# EAGLE design breakout-a-bit (EAGLE 7.7.0)
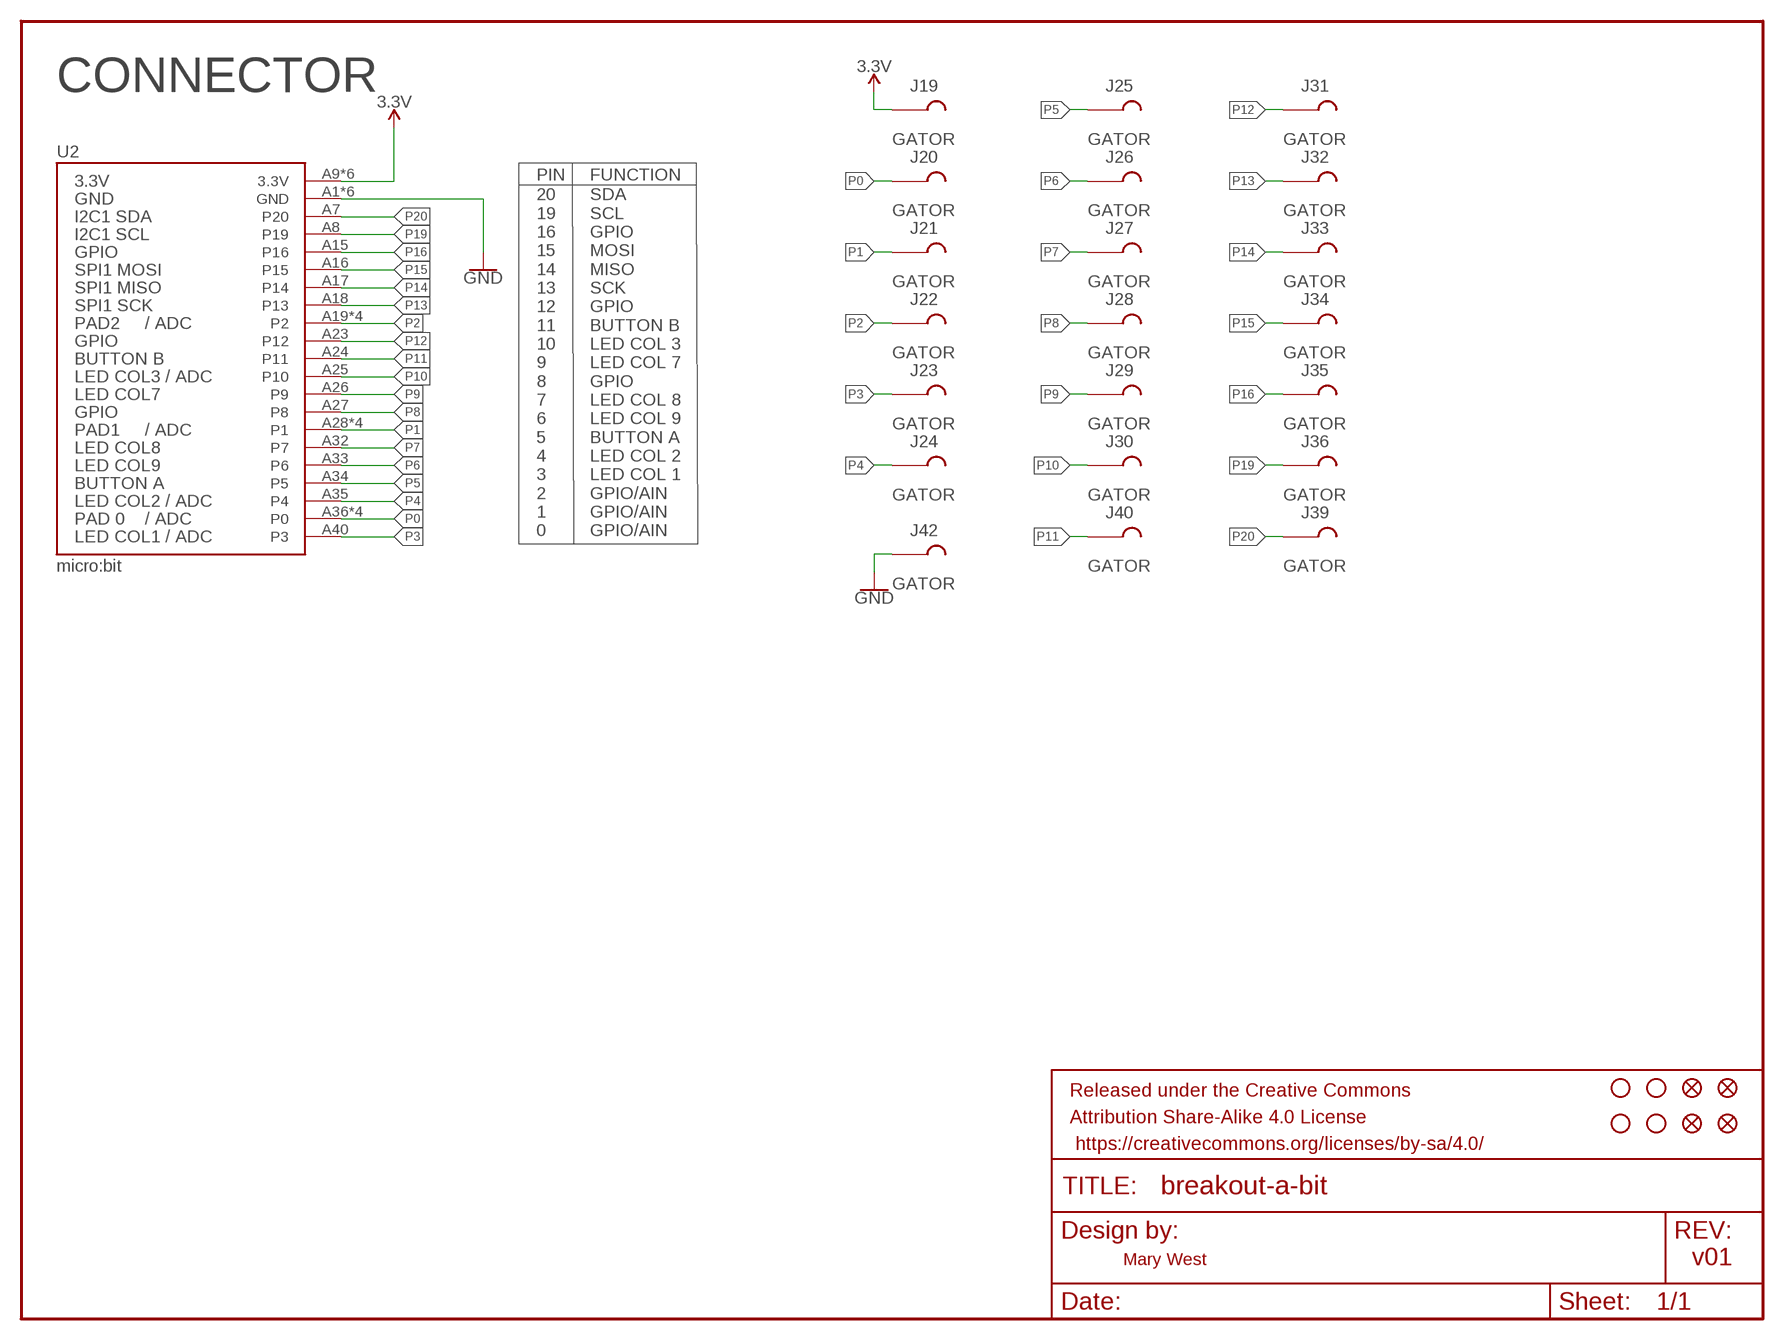
[diagram p0: schematic, sheet 1]

## Parts
FD1  FIDUCIAL1X2  [FIDUCIAL-1X2]
FD2  FIDUCIAL1X2  [FIDUCIAL-1X2]
FD3  FIDUCIAL1X2  [FIDUCIAL-1X2]
FD4  FIDUCIAL1X2  [FIDUCIAL-1X2]
FRAME1  FRAME-LETTER  [CREATIVE_COMMONS]
H1  STAND-OFF  [STAND-OFF]
H2  STAND-OFF  [STAND-OFF]
H3  STAND-OFF  [STAND-OFF]
H4  STAND-OFF  [STAND-OFF]
J19  GATOR  [GATOR]
J20  GATOR  [GATOR]
J21  GATOR  [GATOR]
J22  GATOR  [GATOR]
J23  GATOR  [GATOR]
J24  GATOR  [GATOR]
J25  GATOR  [GATOR]
J26  GATOR  [GATOR]
J27  GATOR  [GATOR]
J28  GATOR  [GATOR]
J29  GATOR  [GATOR]
J30  GATOR  [GATOR]
J31  GATOR  [GATOR]
J32  GATOR  [GATOR]
J33  GATOR  [GATOR]
J34  GATOR  [GATOR]
J35  GATOR  [GATOR]
J36  GATOR  [GATOR]
J39  GATOR  [GATOR]
J40  GATOR  [GATOR]
J42  GATOR  [GATOR]
U2  micro:bit  MICRO:BITLEDS_UP  [MICRO:BIT_RA_PTH]

## Nets
3.3V: J19.P$1 U2.A9(3.3V) U2.A10(3.3V) U2.A11(3.3V) U2.A12(3.3V) U2.A13(3.3V) U2.A14(3.3V)
GND: J42.P$1 U2.A1(GND) U2.A2(GND) U2.A3(GND) U2.A4(GND) U2.A5(GND) U2.A6(GND)
P0: J20.P$1 U2.A36(P0) U2.A37(P0) U2.A38(P0) U2.A39(P0)
P1: J21.P$1 U2.A28(P1) U2.A29(P1) U2.A30(P1) U2.A31(P1)
P2: J22.P$1 U2.A19(P2) U2.A20(P2) U2.A21(P2) U2.A22(P2)
P3: J23.P$1 U2.A40(P3)
P4: J24.P$1 U2.A35(P4)
P5: J25.P$1 U2.A34(P5)
P6: J26.P$1 U2.A33(P6)
P7: J27.P$1 U2.A32(P7)
P8: J28.P$1 U2.A27(P8)
P9: J29.P$1 U2.A26(P9)
P10: J30.P$1 U2.A25(P10)
P11: J40.P$1 U2.A24(P11)
P12: J31.P$1 U2.A23(P12)
P13: J32.P$1 U2.A18(P13)
P14: J33.P$1 U2.A17(P14)
P15: J34.P$1 U2.A16(P15)
P16: J35.P$1 U2.A15(P16)
P19: J36.P$1 U2.A8(P19)
P20: J39.P$1 U2.A7(P20)

## Notes on the sheet
- CONNECTOR
- PIN | FUNCTION
- 20
  19
  16
  15
  14
  13
  12
  11
  10
  9
  8
  7
  6
  5
  4
  3
  2
  1
  0
- SDA
  SCL
  GPIO
  MOSI
  MISO
  SCK
  GPIO
  BUTTON B
  LED COL 3
  LED COL 7
  GPIO
  LED COL 8
  LED COL 9
  BUTTON A
  LED COL 2
  LED COL 1
  GPIO/AIN
  GPIO/AIN
  GPIO/AIN
- Mary West | v01

## Library data of the parts
FD1-FD4 = SparkFun-Aesthetics:FIDUCIAL: Fiducial Alignment Points Point-of-reference for pick-and-place machines and other optical instruments.
FRAME1 = SparkFun-Aesthetics:FRAME-LETTER: Schematic Frame - Letter Standard 8.5x11 US Letter frame
H1-H4 = SparkFun-Electromechanical:STAND-OFF: #4 Stand Off This is the mechanical footprint for a #4 phillips button head screw. Use the keepout ring to avoid running the screw head into surrounding components. SKU : PRT-00447
J19-J36 J39 J40 J42 = TAB:GATOR
U2 = Micro_Bit_Parts:MICRO:BIT: BBC MICRO_BIT with 5x5 LED array facing the direction noted in the variant. "UP" means away from the host board, "Down" means facing towards the host board.; PROD_ID: CONN-13452

## Board
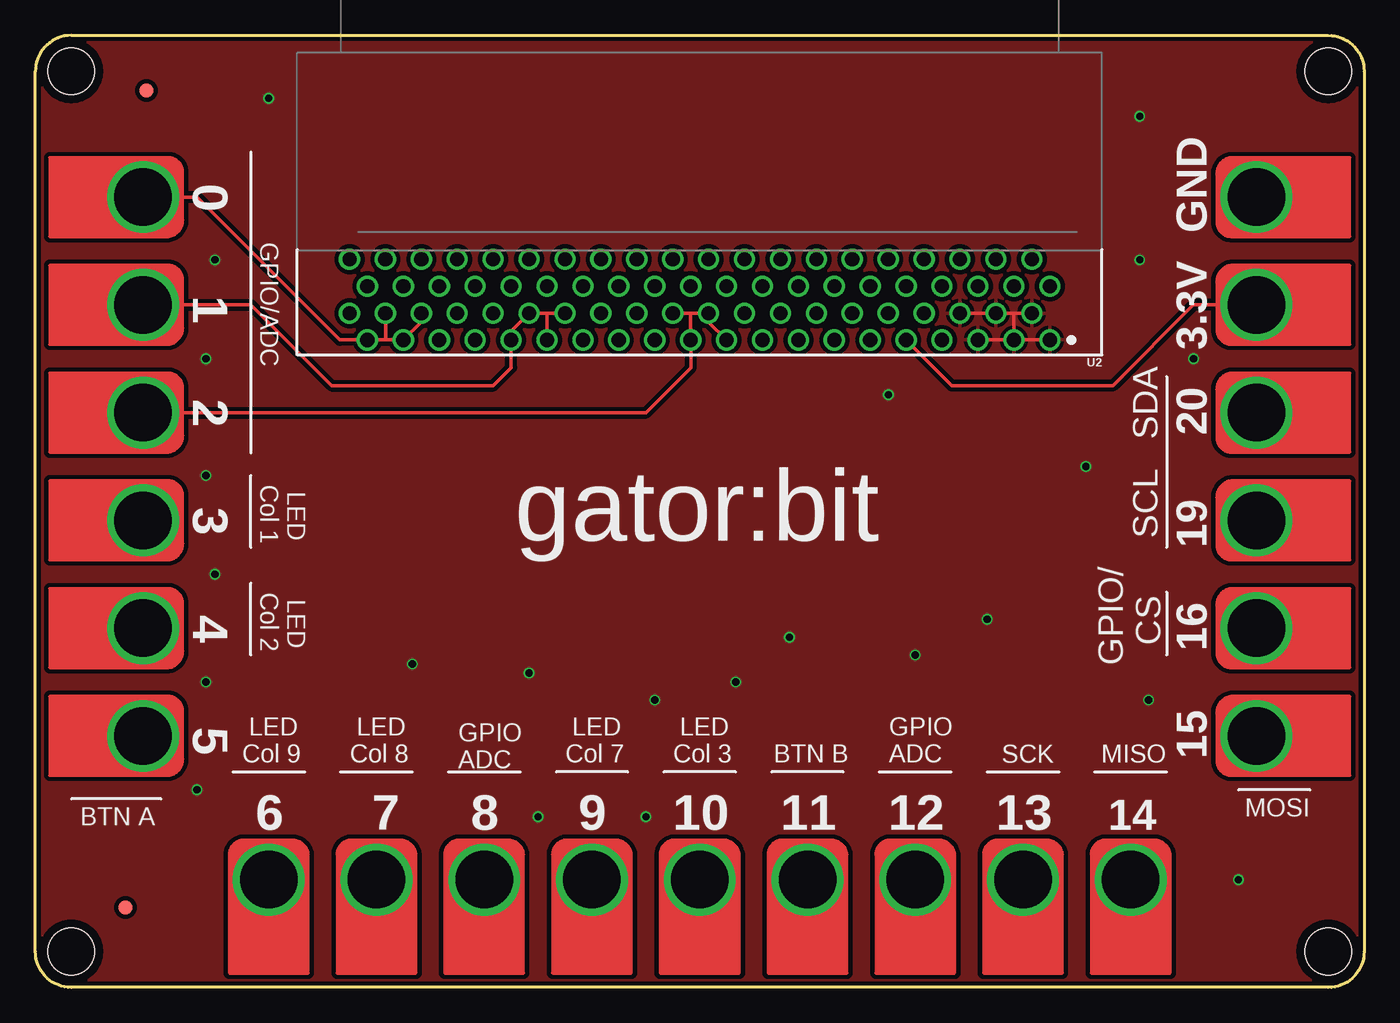
[diagram p1: board, top side]
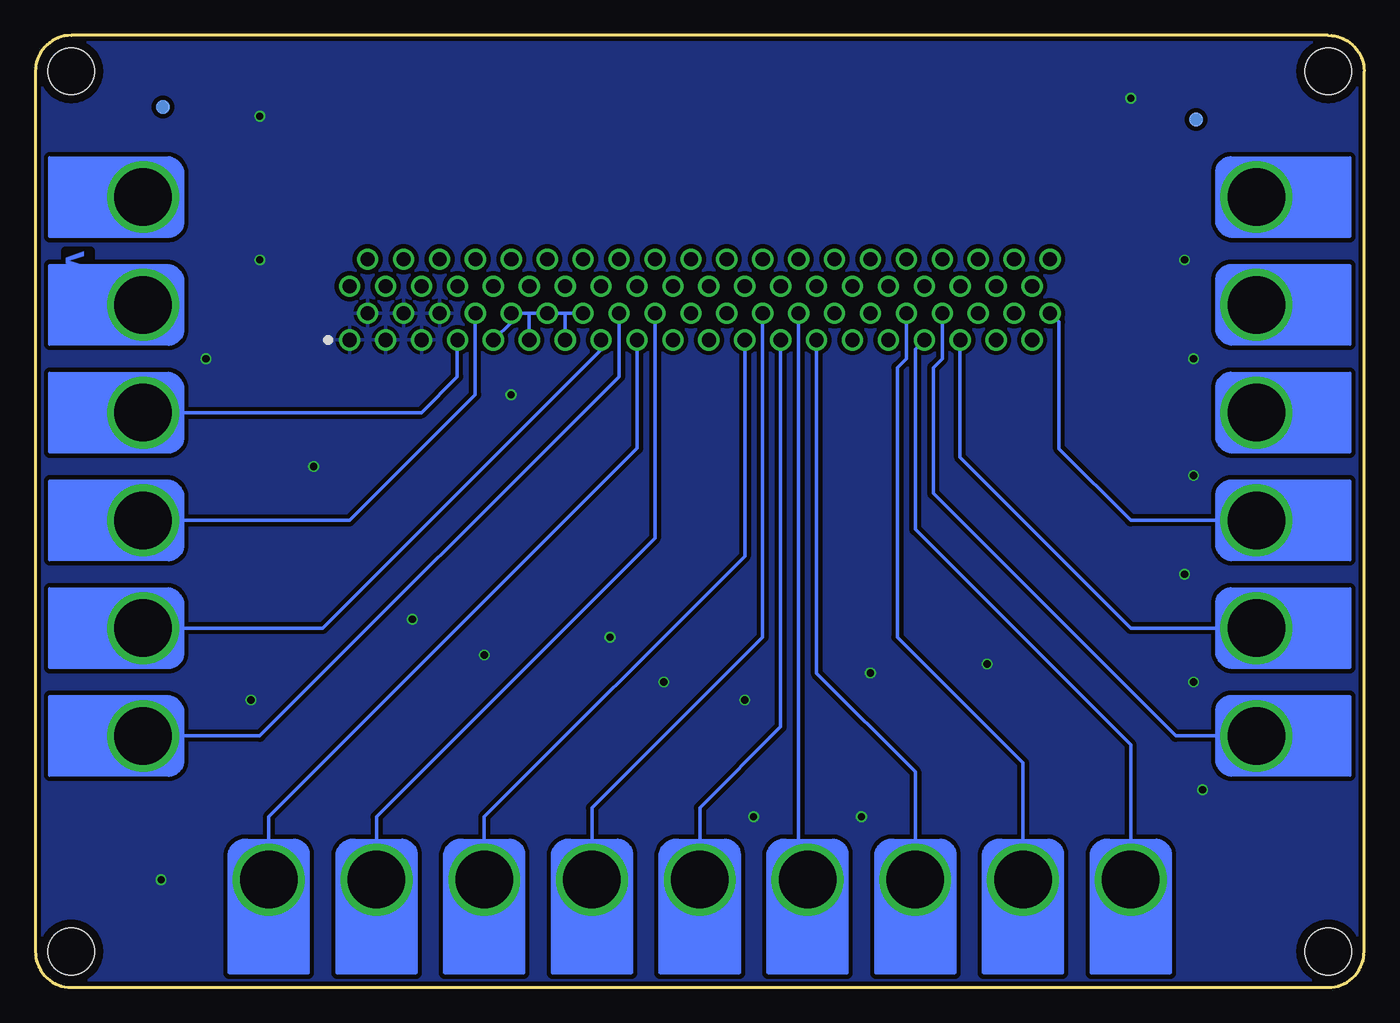
[diagram p2: board, bottom side, seen from below]

Size 93.98 x 67.31 mm. Coordinates in mm from the lower left corner, seen from the top.
Outline: 2.54,67.31 91.44,67.31 arc-90 93.98,64.77 93.98,2.54 arc-90 91.44,0 2.54,0 arc-90 0,2.54 0,64.77 arc-90 2.54,67.31
Copper layers (1*16): Top 0.035mm / dielectric 1.5mm / Bottom 0.035mm
Design rules "SparkFun-2-layer-FAB-LIMIT": minimum track width 4mil, minimum drill 6mil, track to track 4mil, track to pad 4mil, pad to pad 4mil, via to via 4mil, smd to smd 4mil, copper to edge 4mil, drill to drill 4mil, minimum pad ring 5mil, minimum via ring 5mil, stop-mask expansion 4mil, vias tented up to drill 25mil, thermal gap 10mil

### Footprints (pad centres in the part's own frame; a part is rotated, then mirrored left to right if it is on the bottom)
FIDUCIAL-1X2 = smd 1 x 1: 1 0,0
STAND-OFF = hole 3.302: 0,0
GATOR = drill 4.064 pad 5.08: P$1 0,0
MICRO:BIT_RA_PTH = drill 1: A1 -24.765,7.62; A2 -23.495,5.72; A3 -22.225,7.62; A4 -20.955,5.72; A5 -19.685,7.62; A6 -18.415,5.72; A7 -17.145,7.62; A8 -15.875,5.72; A9 -14.605,7.62; A10 -13.335,5.72; A11 -12.065,7.62; A12 -10.795,5.72; A13 -9.525,7.62; A14 -8.255,5.72; A15 -6.985,7.62; A16 -5.715,5.72; A17 -4.445,7.62; A18 -3.175,5.72; A19 -1.905,7.62; A20 -0.635,5.72; A21 0.635,7.62; A22 1.905,5.72; A23 3.175,7.62; A24 4.445,5.72; A25 5.715,7.62; A26 6.985,5.72; A27 8.255,7.62; A28 9.525,5.72; A29 10.795,7.62; A30 12.065,5.72; A31 13.335,7.62; A32 14.605,5.72; A33 15.875,7.62; A34 17.145,5.72; A35 18.415,7.62; A36 19.685,5.72; A37 20.955,7.62; A38 22.225,5.72; A39 23.495,7.62; A40 24.765,5.72; B1 -24.765,3.82; B2 -23.495,1.92; B3 -22.225,3.82; B4 -20.955,1.92; B5 -19.685,3.82; B6 -18.415,1.92; B7 -17.145,3.82; B8 -15.875,1.92; B9 -14.605,3.82; B10 -13.335,1.92; B11 -12.065,3.82; B12 -10.795,1.92; B13 -9.525,3.82; B14 -8.255,1.92; B15 -6.985,3.82; B16 -5.715,1.92; B17 -4.445,3.82; B18 -3.175,1.92; B19 -1.905,3.82; B20 -0.635,1.92; B21 0.635,3.82; B22 1.905,1.92; B23 3.175,3.82; B24 4.445,1.92; B25 5.715,3.82; B26 6.985,1.92; B27 8.255,3.82; B28 9.525,1.92; B29 10.795,3.82; B30 12.065,1.92; B31 13.335,3.82; B32 14.605,1.92; B33 15.875,3.82; B34 17.145,1.92; B35 18.415,3.82; B36 19.685,1.92; B37 20.955,3.82; B38 22.225,1.92; B39 23.495,3.82; B40 24.765,1.92

### Placement (x,y rotation side)
FD1  6.38,5.65 0 top
FD2  7.84,63.4 0 top
FD3  11.87,61.37 0 bottom
FD4  84.96,62.23 0 bottom
FRAME1  25.4,-11.43 0 top  (outside the outline)
H1  2.54,64.77 0 top
H2  91.44,64.77 0 top
H3  2.54,2.54 0 top
H4  91.44,2.54 0 top
J19  86.36,48.26 90 top
J20  7.62,55.88 270 top
J21  7.62,48.26 270 top
J22  7.62,40.64 270 top
J23  7.62,33.02 270 top
J24  7.62,25.4 270 top
J25  7.62,17.78 270 top
J26  16.51,7.62 0 top
J27  24.13,7.62 0 top
J28  31.75,7.62 0 top
J29  39.37,7.62 0 top
J30  46.99,7.62 0 top
J31  62.23,7.62 0 top
J32  69.85,7.62 0 top
J33  77.47,7.62 0 top
J34  86.36,17.78 90 top
J35  86.36,25.4 90 top
J36  86.36,33.02 90 top
J39  86.36,40.64 90 top
J40  54.61,7.62 0 top
J42  86.36,55.88 90 top
U2  46.98,53.39 180 top
U$4  [ORDERING_INSTRUCTIONS]  26.54,-16.64 0 top  (outside the outline)

### Tracks (layer width: path | path; a pad name or v marks a point on that pad's centre or on a via)
3.3V
  Top 0.254: J19.P$1 81.91,48.26 76.2,42.55 64.81,42.55 U2.A9
  Bottom 0.254: U2.A14 56.52,47.67 | 56.52,47.67 U2.A12 | U2.A12 59.05,47.67 | 59.05,47.67 U2.A10 60.32,47.04 U2.A9 | U2.A13 56.51,47.66 56.52,47.67 | U2.A11 59.05,47.66 | 59.05,47.66 59.05,47.67 | 59.05,47.66 U2.A12
GND  (via drill 0.51)
  Top 0.254: U2.A6 69.22,47.67 | 69.22,47.67 U2.A2 | U2.A5 U2.A3 | U2.A3 U2.A1 | U2.A3 69.21,47.66 69.22,47.67
  other vias: 16.51,62.87 12.7,51.44 12.06,44.45 12.06,36.2 12.7,29.21 12.06,21.59 11.43,13.97 26.67,22.86 34.92,22.23 43.81,20.32 49.53,21.59 53.34,24.77 62.23,23.5 67.31,26.04 78.74,20.32 74.3,36.83 60.32,41.91 78.1,51.44 78.1,61.59 81.91,44.45 85.09,7.62 35.56,12.06 43.18,12.06
  pour Top (isolate 0.305): 0,67.31 -0.16,-0.32 93.82,-0.32 93.98,67.31
  pour Bottom (isolate 0.305): 0,67.31 -0.16,-0.32 93.82,-0.32 93.98,67.31
P0
  Top 0.254: 24.76,45.77 U2.A39 21.54,45.77 11.43,55.88 J20.P$1 | 24.76,45.77 U2.A37 27.3,47.04 U2.A36 | U2.A38 24.76,45.78 24.76,45.77
P1
  Top 0.254: J21.P$1 15.24,48.26 20.95,42.55 32.38,42.55 33.66,43.81 U2.A31 33.65,46.4 U2.A30 36.2,47.67 | 36.2,47.67 U2.A28 | U2.A29 36.19,47.66 36.2,47.67
P2
  Top 0.254: J22.P$1 43.18,40.64 46.35,43.81 U2.A21 46.35,47.66 46.35,47.67 | U2.A22 46.35,47.67 | 46.35,47.67 U2.A20 47.62,47.04 U2.A19
P3
  Bottom 0.254: J23.P$1 16.51,33.02 21.59,38.1 21.59,47.05 U2.A40
P4
  Bottom 0.254: J24.P$1 16.51,25.4 28.57,37.47 U2.A35
P5
  Bottom 0.254: J25.P$1 13.33,17.78 30.48,34.92 30.48,43.81 29.84,44.45 U2.A34
P6
  Bottom 0.254: J26.P$1 16.51,17.14 31.75,32.38 31.75,45.13 U2.A33
P7
  Bottom 0.254: U2.A32 32.38,44.46 33.02,43.81 33.02,24.77 24.13,15.88 J27.P$1 24.13,6.99 | 24.13,6.99 22.86,5.71 22.86,8.26 23.49,8.89 23.49,7.62 24.13,6.99
P8
  Bottom 0.254: U2.A27 38.73,22.22 31.75,15.24 31.75,8.26 33.02,6.99 32.38,6.99 J28.P$1
P9
  Bottom 0.254: U2.A26 40,8.25 J29.P$1
P10
  Bottom 0.254: U2.A25 41.27,18.42 46.99,12.7 J30.P$1
P11
  Bottom 0.254: U2.A24 42.54,24.77 54.61,12.7 J40.P$1
P12
  Bottom 0.254: U2.A23 43.81,30.49 62.23,12.06 J31.P$1
P13
  Bottom 0.254: U2.A18 50.16,31.76 69.85,12.06 69.85,8.26 70.48,7.62 70.48,6.99 J32.P$1
P14
  Bottom 0.254: U2.A17 51.43,38.11 77.47,12.06 J33.P$1
P15
  Bottom 0.254: U2.A16 52.7,43.19 78.1,17.78 J34.P$1
P16
  Bottom 0.254: U2.A15 53.97,45.09 73.66,25.4 J35.P$1
P19
  Bottom 0.254: J36.P$1 71.75,33.02 62.87,41.91 U2.A8
P20
  Bottom 0.254: J39.P$1 66.67,40.64 64.13,43.18 U2.A7

### Text on the board
Bottom: v10
tPlace: 0 | GPIO/ADC | GND | 1 | 3.3V | 2 | SDA | 20 | LED / Col 1 | 3 | gator:bit | SCL | 19 | LED / Col 2 | 4 | 16 | GPIO/ / CS | 5 | LED / Col 9 | LED / Col 8 | LED / Col 7 | LED / Col 3 | BTN B | GPIO / ADC | SCK | MISO | 15 | GPIO / ADC | MOSI | BTN A | 6 | 7 | 8 | 9 | 10 | 11 | 12 | 13 | 14
Measures: * All dimensions / are in inches
tDocu: Mary West | Solder Mask: Black Gloss